# Altium schematic sheet mini-SAS.SchDoc
size A4; Organization: Altium Limited; Address1: L3, 12a Rodborough Rd; Address2: Frenchs Forest; Address3: NSW; Address4: Australia 2086
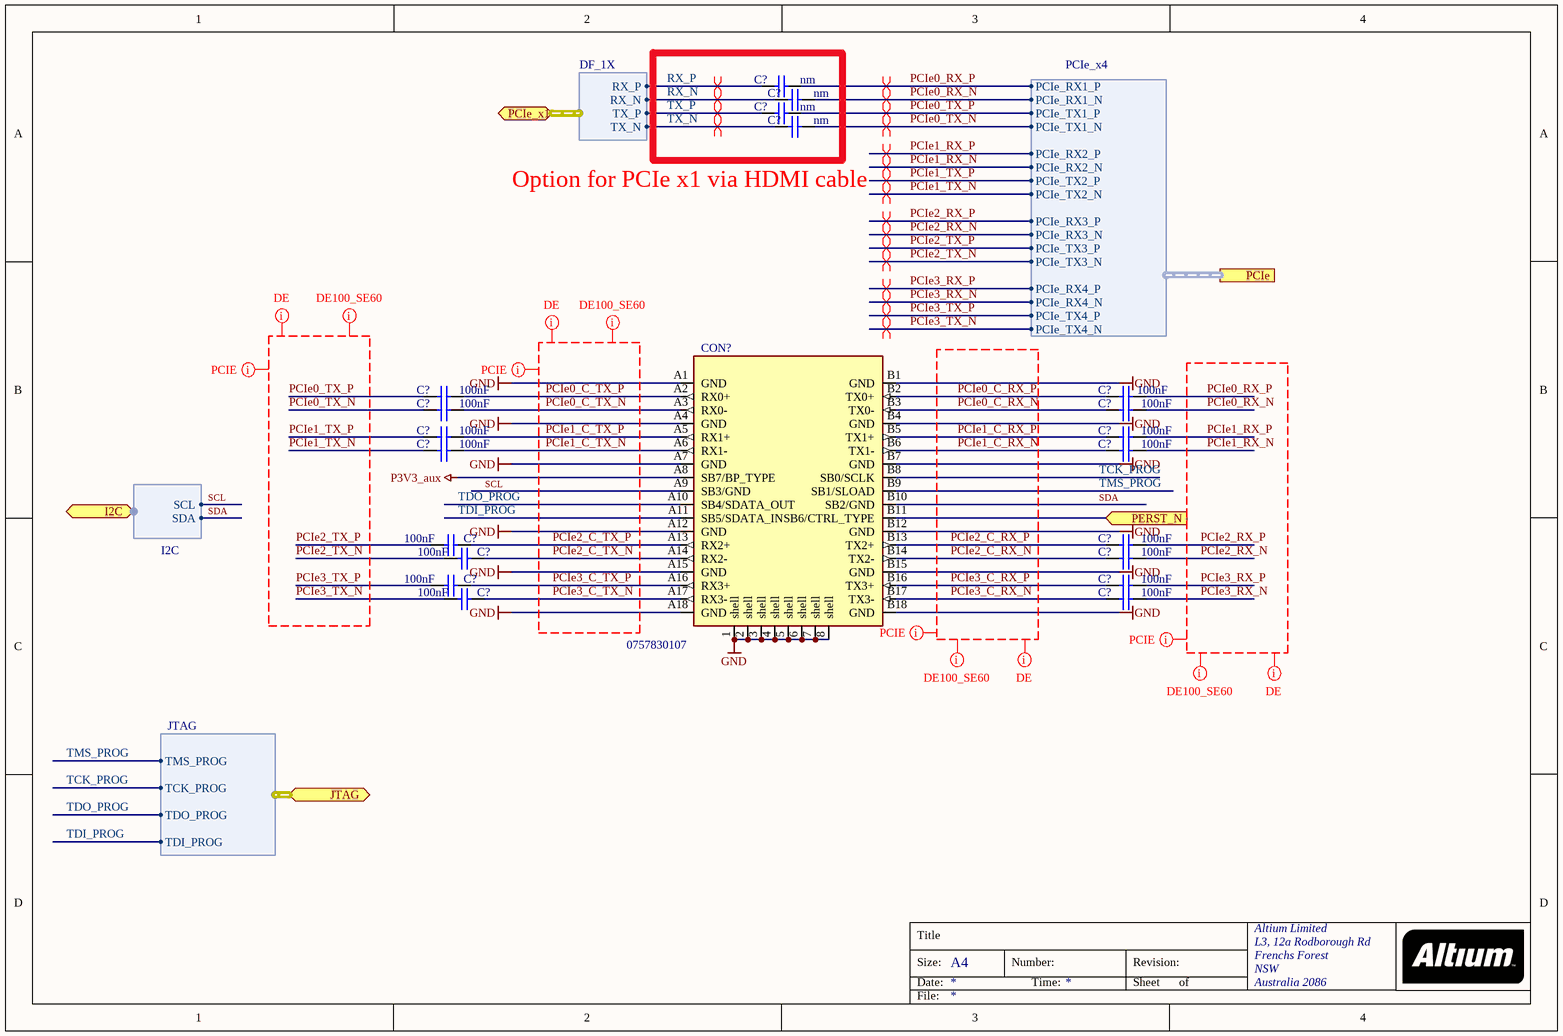
[diagram p0: mini-SAS.SchDoc]

## Parts
(Parts that share a designator on the sheet are numbered #1, #2 ... from top to bottom, then left to right.)
C?#1  nm  [CAPC0603X33N]
C?#2  nm  [CAPC0603X33N]
C?#3  nm  [CAPC0603X33N]
C?#4  nm  [CAPC0603X33N]
C?#5  100nF  [CAPC0603X33N]
C?#6  100nF  [CAPC0603X33N]
C?#7  100nF  [CAPC0603X33N]
C?#8  100nF  [CAPC0603X33N]
C?#9  100nF  [CAPC0603X33N]
C?#10  100nF  [CAPC0603X33N]
C?#11  100nF  [CAPC0603X33N]
C?#12  100nF  [CAPC0603X33N]
C?#13  100nF  [CAPC0603X33N]
C?#14  100nF  [CAPC0603X33N]
C?#15  100nF  [CAPC0603X33N]
C?#16  100nF  [CAPC0603X33N]
C?#17  100nF  [CAPC0603X33N]
C?#18  100nF  [CAPC0603X33N]
C?#19  100nF  [CAPC0603X33N]
C?#20  100nF  [CAPC0603X33N]
CON?  0757830107  [0757830107]

## Ports
I2C (harness I2C), JTAG (harness JTAG), PCIe (harness PCIe_x4), PCIe_x1 (harness DF_1X), PERST_N (in)

## Harnesses
PCIe_x4: PCIe_RX1_P, PCIe_RX1_N, PCIe_RX2_N, PCIe_RX2_P, PCIe_TX1_P, PCIe_TX1_N, PCIe_TX2_N, PCIe_TX2_P, PCIe_RX3_P, PCIe_RX3_N, PCIe_RX4_N, PCIe_RX4_P, PCIe_TX3_P, PCIe_TX3_N, PCIe_TX4_N, PCIe_TX4_P
I2C: SCL, SDA
JTAG: TMS_PROG, TCK_PROG, TDO_PROG, TDI_PROG
DF_1X: RX_N, RX_P, TX_N, TX_P

## Nets
GND: CON?.1(shell) CON?.2(shell) CON?.3(shell) CON?.4(shell) CON?.5(shell) CON?.6(shell) CON?.7(shell) CON?.8(shell) CON?.A1(GND) CON?.A4(GND) CON?.A7(GND) CON?.A12(GND) CON?.A15(GND) CON?.A18(GND) CON?.B1(GND) CON?.B4(GND) CON?.B7(GND) CON?.B12(GND) CON?.B15(GND) CON?.B18(GND)
P3V3_aux: CON?.A8(SB7/BP_TYPE)
PCIe0_C_RX_N: C?#8.1 CON?.B3(TX0-)
PCIe0_C_RX_P: C?#6.1 CON?.B2(TX0+)
PCIe0_C_TX_N: C?#7.2 CON?.A3(RX0-)
PCIe0_C_TX_P: C?#5.2 CON?.A2(RX0+)
PCIe0_RX_N: C?#2.2 C?#8.2 ; port PCIe.PCIe_RX1_N
PCIe0_RX_P: C?#1.2 C?#6.2 ; port PCIe.PCIe_RX1_P
PCIe0_TX_N: C?#4.2 C?#7.1 ; port PCIe.PCIe_TX1_N
PCIe0_TX_P: C?#3.2 C?#5.1 ; port PCIe.PCIe_TX1_P
PCIe1_C_RX_N: C?#12.1 CON?.B6(TX1-)
PCIe1_C_RX_P: C?#10.1 CON?.B5(TX1+)
PCIe1_C_TX_N: C?#11.2 CON?.A6(RX1-)
PCIe1_C_TX_P: C?#9.2 CON?.A5(RX1+)
PCIe1_RX_N: C?#12.2 ; port PCIe.PCIe_RX2_N
PCIe1_RX_P: C?#10.2 ; port PCIe.PCIe_RX2_P
PCIe1_TX_N: C?#11.1 ; port PCIe.PCIe_TX2_N
PCIe1_TX_P: C?#9.1 ; port PCIe.PCIe_TX2_P
PCIe2_C_RX_N: C?#16.1 CON?.B14(TX2-)
PCIe2_C_RX_P: C?#14.1 CON?.B13(TX2+)
PCIe2_C_TX_N: C?#15.1 CON?.A14(RX2-)
PCIe2_C_TX_P: C?#13.1 CON?.A13(RX2+)
PCIe2_RX_N: C?#16.2 ; port PCIe.PCIe_RX3_N
PCIe2_RX_P: C?#14.2 ; port PCIe.PCIe_RX3_P
PCIe2_TX_N: C?#15.2 ; port PCIe.PCIe_TX3_N
PCIe2_TX_P: C?#13.2 ; port PCIe.PCIe_TX3_P
PCIe3_C_RX_N: C?#20.1 CON?.B17(TX3-)
PCIe3_C_RX_P: C?#18.1 CON?.B16(TX3+)
PCIe3_C_TX_N: C?#19.1 CON?.A17(RX3-)
PCIe3_C_TX_P: C?#17.1 CON?.A16(RX3+)
PCIe3_RX_N: C?#20.2 ; port PCIe.PCIe_RX4_N
PCIe3_RX_P: C?#18.2 ; port PCIe.PCIe_RX4_P
PCIe3_TX_N: C?#19.2 ; port PCIe.PCIe_TX4_N
PCIe3_TX_P: C?#17.2 ; port PCIe.PCIe_TX4_P
PERST_N: CON?.B11(SB6/CTRL_TYPE) ; port PERST_N
RX_N: C?#2.1 ; port PCIe_x1.RX_N
RX_P: C?#1.1 ; port PCIe_x1.RX_P
SCL: CON?.A9(SB3/GND) ; port I2C.SCL
SDA: CON?.B10(SB2/GND) ; port I2C.SDA
TCK_PROG: CON?.B8(SB0/SCLK) ; port JTAG.TCK_PROG
TDI_PROG: CON?.A11(SB5/SDATA_IN) ; port JTAG.TDI_PROG
TDO_PROG: CON?.A10(SB4/SDATA_OUT) ; port JTAG.TDO_PROG
TMS_PROG: CON?.B9(SB1/SLOAD) ; port JTAG.TMS_PROG
TX_N: C?#4.1 ; port PCIe_x1.TX_N
TX_P: C?#3.1 ; port PCIe_x1.TX_P

## Layout directives
differential pair: PCIe0_RX_N, PCIe0_RX_P, PCIe0_TX_N, PCIe0_TX_P, PCIe1_RX_N, PCIe1_RX_P, PCIe1_TX_N, PCIe1_TX_P, PCIe2_RX_N, PCIe2_RX_P, PCIe2_TX_N, PCIe2_TX_P, PCIe3_RX_N, PCIe3_RX_P, PCIe3_TX_N, PCIe3_TX_P, RX_N, RX_P, TX_N, TX_P
net class DE: PCIe0_C_RX_N, PCIe0_C_RX_P, PCIe0_C_TX_N, PCIe0_C_TX_P, PCIe0_RX_N, PCIe0_RX_P, PCIe0_TX_N, PCIe0_TX_P, PCIe1_C_RX_N, PCIe1_C_RX_P, PCIe1_C_TX_N, PCIe1_C_TX_P, PCIe1_RX_N, PCIe1_RX_P, PCIe1_TX_N, PCIe1_TX_P, PCIe2_C_RX_N, PCIe2_C_RX_P, PCIe2_C_TX_N, PCIe2_C_TX_P, PCIe2_RX_N, PCIe2_RX_P, PCIe2_TX_N, PCIe2_TX_P, PCIe3_C_RX_N, PCIe3_C_RX_P, PCIe3_C_TX_N, PCIe3_C_TX_P, PCIe3_RX_N, PCIe3_RX_P, PCIe3_TX_N, PCIe3_TX_P
net class DE100_SE60: PCIe0_C_RX_N, PCIe0_C_RX_P, PCIe0_C_TX_N, PCIe0_C_TX_P, PCIe0_RX_N, PCIe0_RX_P, PCIe0_TX_N, PCIe0_TX_P, PCIe1_C_RX_N, PCIe1_C_RX_P, PCIe1_C_TX_N, PCIe1_C_TX_P, PCIe1_RX_N, PCIe1_RX_P, PCIe1_TX_N, PCIe1_TX_P, PCIe2_C_RX_N, PCIe2_C_RX_P, PCIe2_C_TX_N, PCIe2_C_TX_P, PCIe2_RX_N, PCIe2_RX_P, PCIe2_TX_N, PCIe2_TX_P, PCIe3_C_RX_N, PCIe3_C_RX_P, PCIe3_C_TX_N, PCIe3_C_TX_P, PCIe3_RX_N, PCIe3_RX_P, PCIe3_TX_N, PCIe3_TX_P
net class PCIE: PCIe0_C_RX_N, PCIe0_C_RX_P, PCIe0_C_TX_N, PCIe0_C_TX_P, PCIe0_RX_N, PCIe0_RX_P, PCIe0_TX_N, PCIe0_TX_P, PCIe1_C_RX_N, PCIe1_C_RX_P, PCIe1_C_TX_N, PCIe1_C_TX_P, PCIe1_RX_N, PCIe1_RX_P, PCIe1_TX_N, PCIe1_TX_P, PCIe2_C_RX_N, PCIe2_C_RX_P, PCIe2_C_TX_N, PCIe2_C_TX_P, PCIe2_RX_N, PCIe2_RX_P, PCIe2_TX_N, PCIe2_TX_P, PCIe3_C_RX_N, PCIe3_C_RX_P, PCIe3_C_TX_N, PCIe3_C_TX_P, PCIe3_RX_N, PCIe3_RX_P, PCIe3_TX_N, PCIe3_TX_P

## Notes on the sheet
- (near C?#4) Option for PCIe x1 via HDMI cable
- Title
- Size:
- Date:
- A4
- Number:
- Time:
- Revision:
- Sheet
- of
- File:

## Library data of the parts
C?#1-C?#4 = CC0201_100NF_6.3V_10%_X5R: Non-polarised capacitor; Part Description: SMD Multilayer Chip Ceramic Capacitor; Manufacturer: GENERIC; Manufacturer1 Part Number: 02016D104KAT2A; Value: 100nF; Voltage: 6.3V; TC: X5R; Tolerance: ±10%; Table: Capacitors SMD; Part Number: CC0201_100NF_6.3V_10%_X5R; Component Kind: Standard; Component Type: Standard; Pin Count: 2; Status: Not Recommended; Manufacturer Part Number: CC0201_100NF_6.3V_10%_X5R; Case: 0201; Mounted: Yes; Socket: No; SMD: Yes; Manufacturer1 Example: AVX; Manufacturer1 ComponentHeight: 0.33mm; HelpURL: \\cern.ch\dfs\Applications\Altium\Datasheets\CC0201_X5R_AVX.pdf; Author: CERN DEM JLC; CreateDate: 2007-12-03; LatestRevisionDate: 2007-12-03
C?#5-C?#20 = CC0201_100NF_6.3V_10%_X5R: Non-polarised capacitor; Part Description: SMD Multilayer Chip Ceramic Capacitor; Manufacturer: GENERIC; Manufacturer1 Part Number: 02016D104KAT2A; Voltage: 6.3V; TC: X5R; Tolerance: ±10%; Table: Capacitors SMD; Part Number: CC0201_100NF_6.3V_10%_X5R; Component Kind: Standard; Component Type: Standard; Pin Count: 2; Value: 100nF; Status: Not Recommended; Manufacturer Part Number: CC0201_100NF_6.3V_10%_X5R; Case: 0201; Mounted: Yes; Socket: No; SMD: Yes; Manufacturer1 Example: AVX; Manufacturer1 ComponentHeight: 0.33mm; HelpURL: \\cern.ch\dfs\Applications\Altium\Datasheets\CC0201_X5R_AVX.pdf; Author: CERN DEM JLC; CreateDate: 2007-12-03; LatestRevisionDate: 2007-12-03
CON? = CON_miniSAS_RA: I-Pass right angle connector; Manufacturer: MOLEX; .Checked PCB: PZ; .Checked SCH: PZ; Manufacturer1 Example: MOLEX; Manufacturer1 Part Number: 0757830107; Manufacturer Part Number: 0757830107; Supplier 1: Digi-Key; Supplier Part Number 1: 0757830107-ND; Category: Connector